# Altium schematic sheet 2016_BeaconEye.SchDoc
size A2
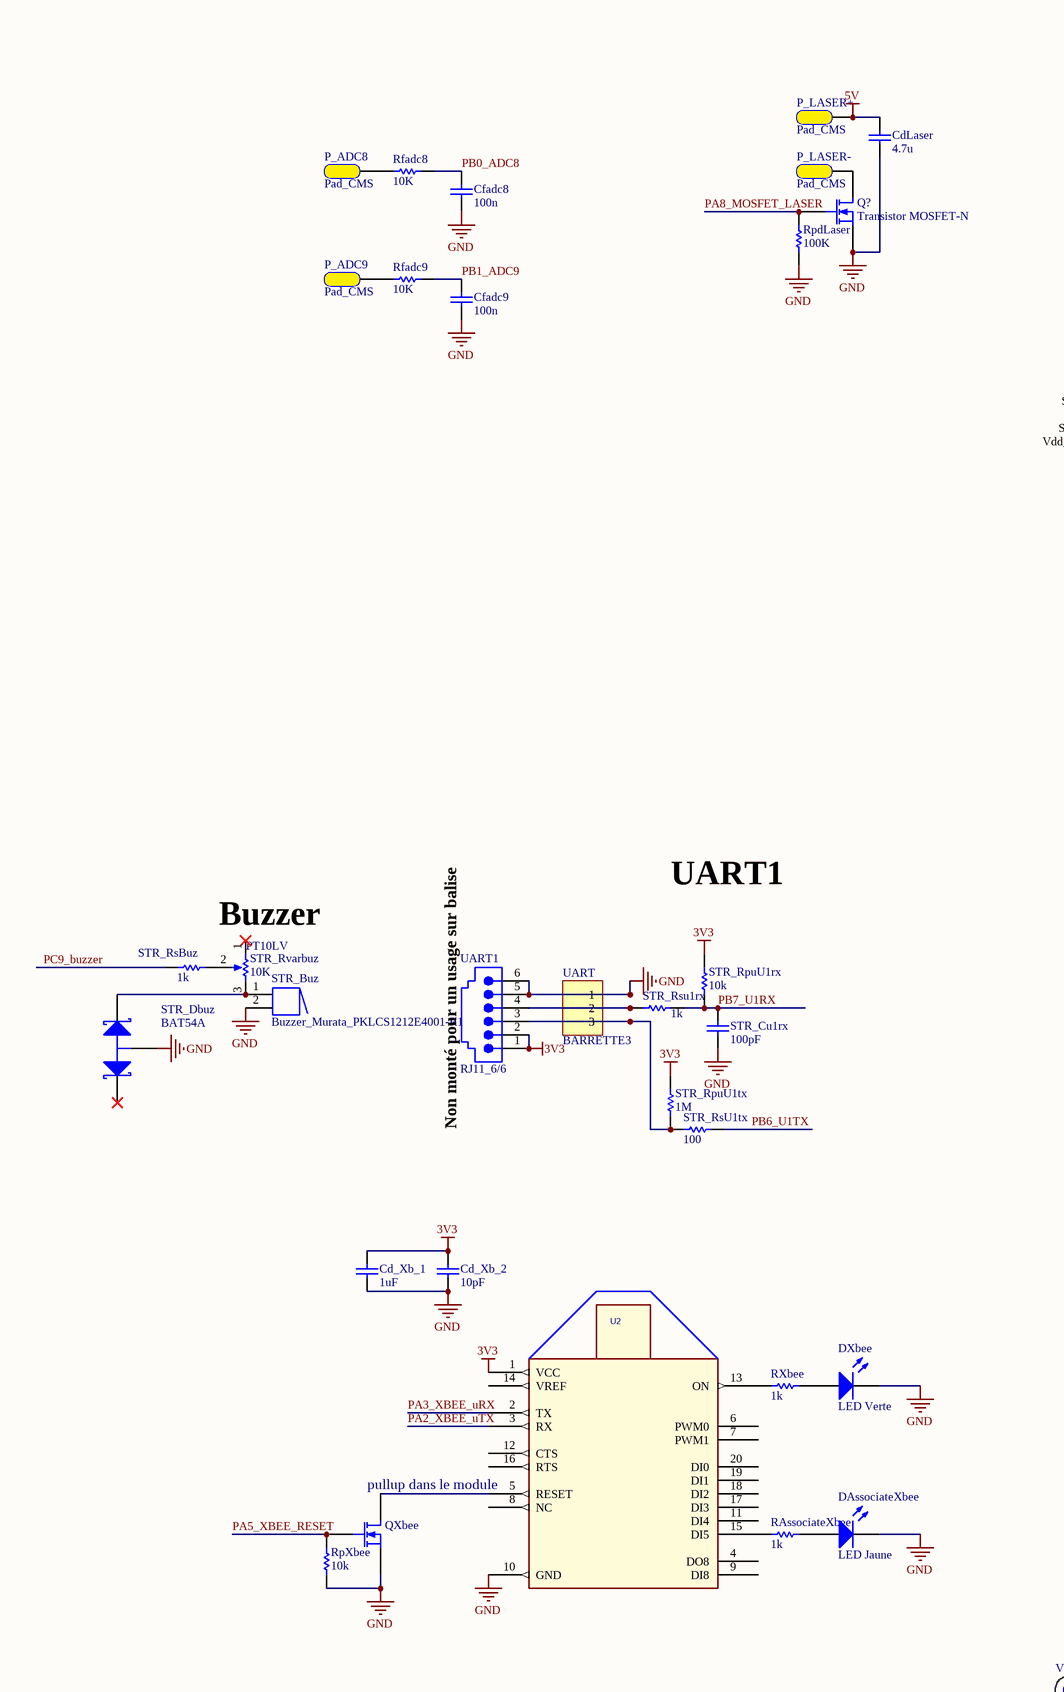
[diagram p0: 2016_BeaconEye.SchDoc, left]
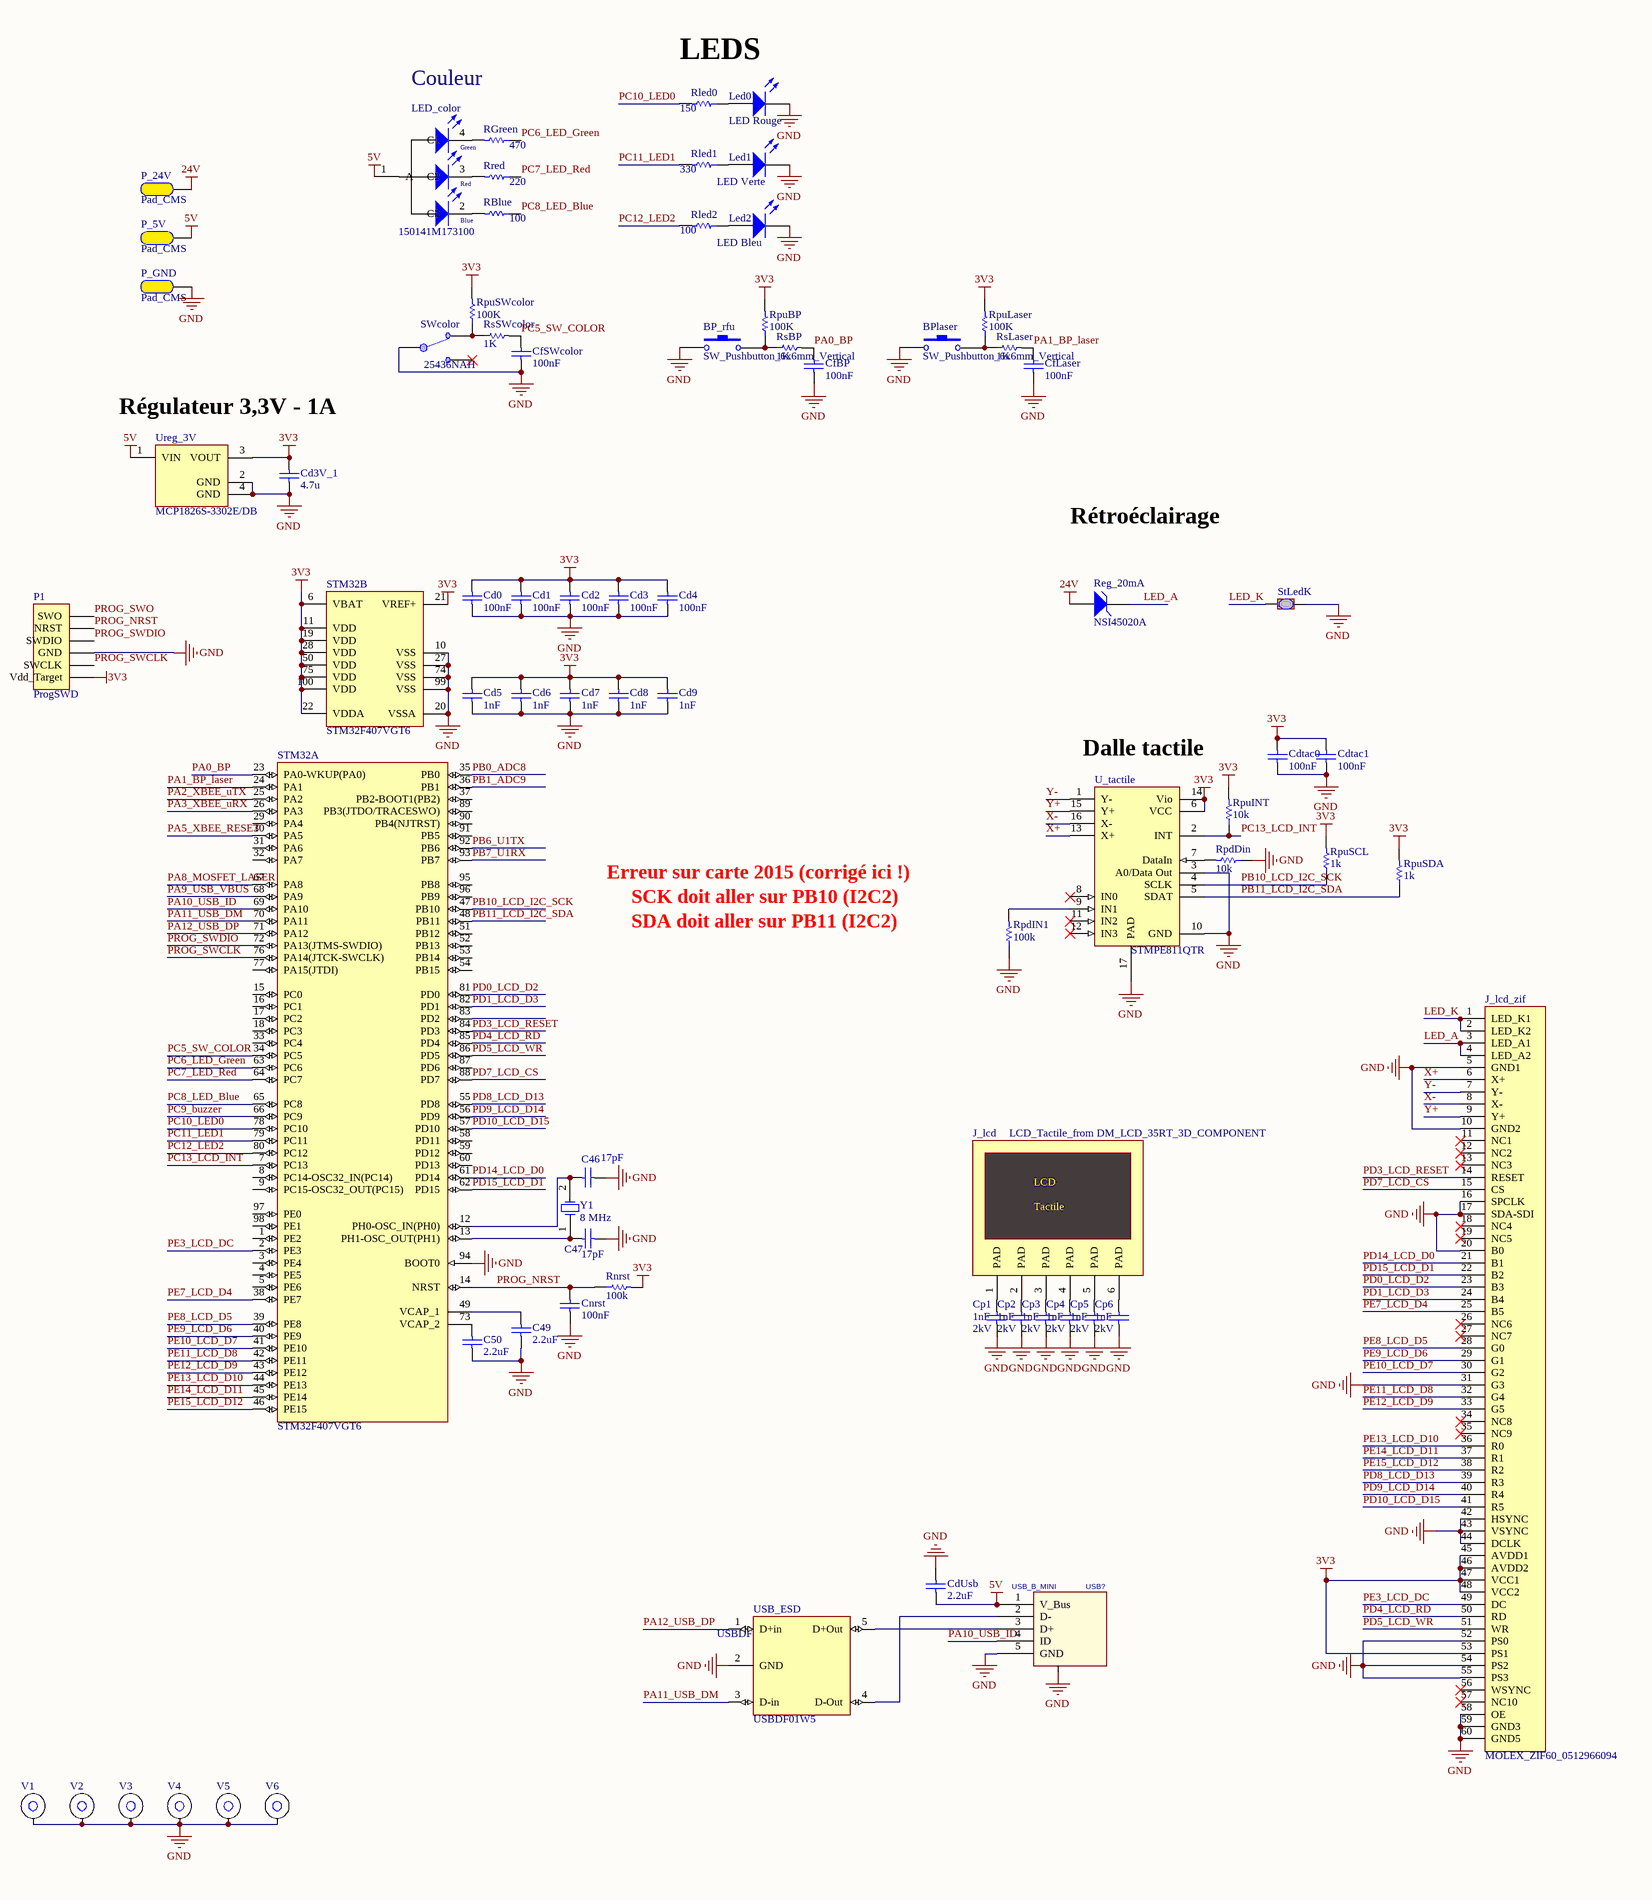
[diagram p1: 2016_BeaconEye.SchDoc, right]

## Parts
BP_rfu  SW_Pushbutton_6x6mm_Vertical  [Switch 6x6 Vertical]
BPlaser  SW_Pushbutton_6x6mm_Vertical  [Switch 6x6 Vertical]
C46  17pF  [C0805_N]
C47  17pF  [C0805_N]
C49  2.2uF  [C0805_N]
C50  2.2uF  [C0805_N]
Cd0  100nF  [C0805_N]
Cd1  100nF  [C0805_N]
Cd2  100nF  [C0805_N]
Cd3  100nF  [C0805_N]
Cd3V_1  4.7u  [C0805_N]
Cd4  100nF  [C0805_N]
Cd5  1nF  [C0805_N]
Cd6  1nF  [C0805_N]
Cd7  1nF  [C0805_N]
Cd8  1nF  [C0805_N]
Cd9  1nF  [C0805_N]
Cd_Xb_1  1uF  [C0805_N]
Cd_Xb_2  10pF  [C0805_N]
CdLaser  4.7u  [C0805_N]
Cdtac0  100nF  [C0805_N]
Cdtac1  100nF  [C0805_N]
CdUsb  2.2uF  [C0805_N]
Cfadc8  100n  [C0805_N]
Cfadc9  100n  [C0805_N]
CfBP  100nF  [C0805_N]
CfLaser  100nF  [C0805_N]
CfSWcolor  100nF  [C0805_N]
Cnrst  100nF  [C0805_N]
Cp1  1nF  Voltage: 2kV  [C1206_N]
Cp2  1nF  Voltage: 2kV  [C1206_N]
Cp3  1nF  Voltage: 2kV  [C1206_N]
Cp4  1nF  Voltage: 2kV  [C1206_N]
Cp5  1nF  Voltage: 2kV  [C1206_N]
Cp6  1nF  Voltage: 2kV  [C1206_N]
DAssociateXbee  LED Jaune  [LED_0805]
DXbee  LED Verte  [LED_0805]
J_lcd  LCD_Tactile_from DM_LCD_35RT_3D_COMPONENT  [LCD_FS-K350QVG-V2-F-01]
J_lcd_zif  MOLEX_ZIF60_0512966094  [ZIF60_0.5MM]
Led0  LED Rouge  [LED_0805]
Led1  LED Verte  [LED_0805]
Led2  LED Bleu  [LED_0805]
LED_color  150141M173100  [3528]
P1  ProgSWD  [HDR1X6]
P_5V  Pad_CMS  [PAD_CMS_5.08x2.54]
P_24V  Pad_CMS  [PAD_CMS_5.08x2.54]
P_ADC8  Pad_CMS  [PAD_CMS_5.08x2.54]
P_ADC9  Pad_CMS  [PAD_CMS_5.08x2.54]
P_GND  Pad_CMS  [PAD_CMS_5.08x2.54]
P_LASER+  Pad_CMS  [PAD_CMS_5.08x2.54]
P_LASER-  Pad_CMS  [PAD_CMS_5.08x2.54]
Q?  Transistor MOSFET-N  [SOT23-3N]
QXbee  Transistor MOSFET-N  [SOT23-3N]  (value not drawn)
RAssociateXbee  1k  [R1206_N]
RBlue  100  [R1206_N]
Reg_20mA  NSI45020A  [SOD123]
Rfadc8  10K  [R1206_N]
Rfadc9  10K  [R1206_N]
RGreen  470  [R1206_N]
Rled0  150  [R1206_N]
Rled1  330  [R1206_N]
Rled2  100  [R1206_N]
Rnrst  100k  [R1206_N]
RpdDin  10k  [R1206_N]
RpdIN1  100k  [R1206_N]
RpdLaser  100K  [R1206_N]
RpuBP  100K  [R1206_N]
RpuINT  10k  [R1206_N]
RpuLaser  100K  [R1206_N]
RpuSCL  1k  [R1206_N]
RpuSDA  1k  [R1206_N]
RpuSWcolor  100K  [R1206_N]
RpXbee  10k  [R1206_N]
Rred  220  [R1206_N]
RsBP  1K  [R1206_N]
RsLaser  1K  [R1206_N]
RsSWcolor  1K  [R1206_N]
RXbee  1k  [R1206_N]
StLedK  Goutte Strap_2  [Goutte Strap_2 Pads_Clearance 0.254mm]  (value not drawn)
STM32  STM32F407VGT6  [STM-LQFP100_N]  (parts A,B of 2)
STR_Buz  Buzzer_Murata_PKLCS1212E4001-R1  [Buzzer_Murata PKLCS1212]
STR_Cu1rx  100pF  [C0805_N]
STR_Dbuz  BAT54A  [SOT23-3N]
STR_RpuU1rx  10k  [R1206_N]
STR_RpuU1tx  1M  [R1206_N]
STR_RsBuz  1k  [R1206_N]
STR_Rsu1rx  1k  [R1206_N]
STR_RsU1tx  100  [R1206_N]
STR_Rvarbuz  value 10K  Type: PT10LV  [Trimmer_Bourns_3314G]  (hidden comment: RESISTANCE_VARIABLE_TRAVERSANTE : PT10LV)
SWcolor  25436NAH  [SW_UNIPOL_DROIT - APEM 18235]
U2  XBee  [MODULE_XBEE]  (value not drawn)
U_tactile  STMPE811QTR  [QFN50P300X300X100_HS-17N]
UART  BARRETTE3  [HDR1X3]
UART1  RJ11_6/6  [RJ11_6/6]
Ureg_3V  MCP1826S-3302E/DB  [SOT223-4N]
USB?  USB_B_MINI  [USB_MICROAB_VERTICAL]
USB_ESD  USBDF01W5  [SOT353_N]
V1  Entretoise WURTH CMS  [ENTRETOISE_CMS]  (value not drawn)
V2  Entretoise WURTH CMS  [ENTRETOISE_CMS]  (value not drawn)
V3  Entretoise WURTH CMS  [ENTRETOISE_CMS]  (value not drawn)
V4  Entretoise WURTH CMS  [ENTRETOISE_CMS]  (value not drawn)
V5  Entretoise WURTH CMS  [ENTRETOISE_CMS]  (value not drawn)
V6  Entretoise WURTH CMS  [ENTRETOISE_CMS]  (value not drawn)
Y1  8 MHz  [HC49/4H_SMX]

## Nets
3V3: Cd0.2 Cd1.2 Cd2.2 Cd3.2 Cd3V_1.2 Cd4.2 Cd5.2 Cd6.2 Cd7.2 Cd8.2 Cd9.2 Cd_Xb_1.2 Cd_Xb_2.2 Cdtac0.2 Cdtac1.2 J_lcd_zif.45(AVDD1) J_lcd_zif.46(AVDD2) J_lcd_zif.47(VCC1) J_lcd_zif.48(VCC2) J_lcd_zif.53(PS1) P1.1(Vdd_Target) Rnrst.2 RpuBP.2 RpuINT.2 RpuLaser.2 RpuSCL.2 RpuSDA.2 RpuSWcolor.2 STM32.6(VBAT) STM32.11(VDD) STM32.19(VDD) STM32.21(VREF+) STM32.22(VDDA) STM32.28(VDD) STM32.50(VDD) STM32.75(VDD) STM32.100(VDD) STR_RpuU1rx.2 STR_RpuU1tx.2 U2.1(VCC) U_tactile.6(VCC) U_tactile.14(Vio) UART1.1 UART1.2 Ureg_3V.3(VOUT)
5V: CdLaser.2 CdUsb.1 LED_color.1(A) P_5V.1 P_LASER+.1 Ureg_3V.1(VIN) USB?.1(V_Bus)
24V: P_24V.1 Reg_20mA.1(A)
GND: BP_rfu.1 BPlaser.1 C46.1 C47.1 C49.1 C50.1 Cd0.1 Cd1.1 Cd2.1 Cd3.1 Cd3V_1.1 Cd4.1 Cd5.1 Cd6.1 Cd7.1 Cd8.1 Cd9.1 Cd_Xb_1.1 Cd_Xb_2.1 CdLaser.1 Cdtac0.1 Cdtac1.1 CdUsb.2 Cfadc8.1 Cfadc9.1 CfBP.1 CfLaser.1 CfSWcolor.1 Cnrst.1 Cp1.1 Cp2.1 Cp3.1 Cp4.1 Cp5.1 Cp6.1 DAssociateXbee.2(K) DXbee.2(K) J_lcd_zif.5(GND1) J_lcd_zif.10(GND2) J_lcd_zif.16(SPCLK) J_lcd_zif.17(SDA-SDI) J_lcd_zif.20(B0) J_lcd_zif.31(G3) J_lcd_zif.42(HSYNC) J_lcd_zif.43(VSYNC) J_lcd_zif.44(DCLK) J_lcd_zif.52(PS0) J_lcd_zif.54(PS2) J_lcd_zif.55(PS3) J_lcd_zif.58(OE) J_lcd_zif.59(GND3) J_lcd_zif.60(GND5) Led0.2(K) Led1.2(K) Led2.2(K) P1.3(GND) P_GND.1 Q?.2(S) QXbee.2(S) RpdDin.1 RpdIN1.1 RpdLaser.1 RpXbee.2 StLedK.2 STM32.10(VSS) STM32.20(VSSA) STM32.27(VSS) STM32.74(VSS) STM32.94(BOOT0) STM32.99(VSS) STR_Buz.2 STR_Cu1rx.1 STR_Dbuz.3(A) SWcolor.COMMON1 U2.10(GND) U_tactile.3(A0/Data_Out) U_tactile.10(GND) U_tactile.17(PAD) UART.1 UART1.5 UART1.6 Ureg_3V.2(GND) Ureg_3V.4(GND) USB?.5(GND) USB?.6(Blindage) USB_ESD.2(GND) V1.1 V2.1 V3.1 V4.1 V5.1 V6.1
LED_A: J_lcd_zif.3(LED_A1) J_lcd_zif.4(LED_A2) Reg_20mA.2(K)
LED_K: J_lcd_zif.1(LED_K1) J_lcd_zif.2(LED_K2) StLedK.1
PA0_BP: CfBP.2 RsBP.2 STM32.23(PA0-WKUP(PA0))
PA1_BP_laser: CfLaser.2 RsLaser.2 STM32.24(PA1)
PA2_XBEE_uTX: STM32.25(PA2) U2.3(RX)
PA3_XBEE_uRX: STM32.26(PA3) U2.2(TX)
PA5_XBEE_RESET: QXbee.1(G) RpXbee.1 STM32.30(PA5)
PA8_MOSFET_LASER: Q?.1(G) RpdLaser.2 STM32.67(PA8)
PA9_USB_VBUS: STM32.68(PA9)
PA10_USB_ID: STM32.69(PA10) USB?.4(ID)
PA11_USB_DM: STM32.70(PA11) USB_ESD.3(D-in)
PA12_USB_DP: STM32.71(PA12) USB_ESD.1(D+in)
PB0_ADC8: Cfadc8.2 Rfadc8.1 STM32.35(PB0)
PB1_ADC9: Cfadc9.2 Rfadc9.1 STM32.36(PB1)
PB6_U1TX: STM32.92(PB6) STR_RsU1tx.2
PB7_U1RX: STM32.93(PB7) STR_Cu1rx.2 STR_RpuU1rx.1 STR_Rsu1rx.1
PB10_LCD_I2C_SCK: RpuSCL.1 STM32.47(PB10) U_tactile.4(SCLK)
PB11_LCD_I2C_SDA: RpuSDA.1 STM32.48(PB11) U_tactile.5(SDAT)
PC5_SW_COLOR: CfSWcolor.2 RsSWcolor.2 STM32.34(PC5)
PC6_LED_Green: RGreen.1 STM32.63(PC6)
PC7_LED_Red: Rred.1 STM32.64(PC7)
PC8_LED_Blue: RBlue.1 STM32.65(PC8)
PC9_buzzer: STM32.66(PC9) STR_RsBuz.1
PC10_LED0: Rled0.2 STM32.78(PC10)
PC11_LED1: Rled1.2 STM32.79(PC11)
PC12_LED2: Rled2.2 STM32.80(PC12)
PC13_LCD_INT: RpuINT.1 STM32.7(PC13) U_tactile.2(INT)
PD0_LCD_D2: J_lcd_zif.23(B3) STM32.81(PD0)
PD1_LCD_D3: J_lcd_zif.24(B4) STM32.82(PD1)
PD3_LCD_RESET: J_lcd_zif.14(RESET) STM32.84(PD3)
PD4_LCD_RD: J_lcd_zif.50(RD) STM32.85(PD4)
PD5_LCD_WR: J_lcd_zif.51(WR) STM32.86(PD5)
PD7_LCD_CS: J_lcd_zif.15(CS) STM32.88(PD7)
PD8_LCD_D13: J_lcd_zif.39(R3) STM32.55(PD8)
PD9_LCD_D14: J_lcd_zif.40(R4) STM32.56(PD9)
PD10_LCD_D15: J_lcd_zif.41(R5) STM32.57(PD10)
PD14_LCD_D0: J_lcd_zif.21(B1) STM32.61(PD14)
PD15_LCD_D1: J_lcd_zif.22(B2) STM32.62(PD15)
PE3_LCD_DC: J_lcd_zif.49(DC) STM32.2(PE3)
PE7_LCD_D4: J_lcd_zif.25(B5) STM32.38(PE7)
PE8_LCD_D5: J_lcd_zif.28(G0) STM32.39(PE8)
PE9_LCD_D6: J_lcd_zif.29(G1) STM32.40(PE9)
PE10_LCD_D7: J_lcd_zif.30(G2) STM32.41(PE10)
PE11_LCD_D8: J_lcd_zif.32(G4) STM32.42(PE11)
PE12_LCD_D9: J_lcd_zif.33(G5) STM32.43(PE12)
PE13_LCD_D10: J_lcd_zif.36(R0) STM32.44(PE13)
PE14_LCD_D11: J_lcd_zif.37(R1) STM32.45(PE14)
PE15_LCD_D12: J_lcd_zif.38(R2) STM32.46(PE15)
PROG_NRST: Cnrst.2 P1.5(NRST) Rnrst.1 STM32.14(NRST)
PROG_SWCLK: P1.2(SWCLK) STM32.76(PA14(JTCK-SWCLK))
PROG_SWDIO: P1.4(SWDIO) STM32.72(PA13(JTMS-SWDIO))
PROG_SWO: P1.6(SWO)
X+: J_lcd_zif.6(X+) U_tactile.13(X+)
X-: J_lcd_zif.8(X-) U_tactile.16(X-)
Y+: J_lcd_zif.9(Y+) U_tactile.15(Y+)
Y-: J_lcd_zif.7(Y-) U_tactile.1(Y-)
NetBP_rfu_3: BP_rfu.3 RpuBP.1 RsBP.1
NetBPlaser_3: BPlaser.3 RpuLaser.1 RsLaser.1
NetC46_2: C46.2 STM32.12(PH0-OSC_IN(PH0)) Y1.2(OSC2)
NetC47_2: C47.2 STM32.13(PH1-OSC_OUT(PH1)) Y1.1(OSC1)
NetC49_2: C49.2 STM32.49(VCAP_1)
NetC50_2: C50.2 STM32.73(VCAP_2)
NetCp1_2: Cp1.2 J_lcd.1(PAD)
NetCp2_2: Cp2.2 J_lcd.2(PAD)
NetCp3_2: Cp3.2 J_lcd.3(PAD)
NetCp4_2: Cp4.2 J_lcd.4(PAD)
NetCp5_2: Cp5.2 J_lcd.5(PAD)
NetCp6_2: Cp6.2 J_lcd.6(PAD)
NetDAssociateXbee_1: DAssociateXbee.1(A) RAssociateXbee.2
NetDXbee_1: DXbee.1(A) RXbee.2
NetLed0_1: Led0.1(A) Rled0.1
NetLed1_1: Led1.1(A) Rled1.1
NetLed2_1: Led2.1(A) Rled2.1
NetLED_color_2: LED_color.2(C3) RBlue.2
NetLED_color_3: LED_color.3(C2) Rred.2
NetLED_color_4: LED_color.4(C1) RGreen.2
NetP_ADC8_1: P_ADC8.1 Rfadc8.2
NetP_ADC9_1: P_ADC9.1 Rfadc9.2
NetP_LASER-_1: P_LASER-.1 Q?.3(D)
NetQXbee_3: QXbee.3(D) U2.5(RESET)
NetRAssociateXbee_1: RAssociateXbee.1 U2.15(DI5)
NetRpdDin_2: RpdDin.2 U_tactile.7(DataIn)
NetRpdIN1_2: RpdIN1.2 U_tactile.9(IN1)
NetRpuSWcolor_1: RpuSWcolor.1 RsSWcolor.1 SWcolor.NC1
NetRXbee_1: RXbee.1 U2.13(ON)
NetSTR_Buz_1: STR_Buz.1 STR_Dbuz.1(K1) STR_Rvarbuz.3
NetSTR_RpuU1tx_1: STR_RpuU1tx.1 STR_RsU1tx.1 UART.3 UART1.3
NetSTR_RsBuz_2: STR_RsBuz.2 STR_Rvarbuz.2
NetSTR_Rsu1rx_2: STR_Rsu1rx.2 UART.2 UART1.4
NetUSB?_2: USB?.2(D-) USB_ESD.4(D-Out)
NetUSB?_3: USB?.3(D+) USB_ESD.5(D+Out)

Not connected (* = marked no-connect by the designer): J_lcd_zif 11(NC1)* 12(NC2)* 13(NC3)* 18(NC4)* 19(NC5)* 26(NC6)* 27(NC7)* 34(NC8)* 35(NC9)* 56(WSYNC)* 57(NC10)*; STM32 1(PE2) 3(PE4) 4(PE5) 5(PE6) 8(PC14-OSC32_IN(PC14)) 9(PC15-OSC32_OUT(PC15)) 15(PC0) 16(PC1) 17(PC2) 18(PC3) 29(PA4) 31(PA6) 32(PA7) 33(PC4) 37(PB2-BOOT1(PB2)) 51(PB12) 52(PB13) 53(PB14) 54(PB15) 58(PD11) 59(PD12) 60(PD13) 77(PA15(JTDI)) 83(PD2) 87(PD6) 89(PB3(JTDO/TRACESWO)) 90(PB4(NJTRST)) 91(PB5) 95(PB8) 96(PB9) 97(PE0) 98(PE1); STR_Dbuz 2(K2)*; STR_Rvarbuz 1*; SWcolor NO1*; U2 4(DO8) 6(PWM0) 7(PWM1) 8(NC) 9(DI8) 11(DI4) 12(CTS) 14(VREF) 16(RTS) 17(DI3) 18(DI2) 19(DI1) 20(DI0); U_tactile 8(IN0)* 11(IN2)* 12(IN3)*

## Notes on the sheet
- Couleur
- LEDS
- Régulateur 3,3V - 1A
- Rétroéclairage
- Dalle tactile
- Erreur sur carte 2015 (corrigé ici !)
- SCK doit aller sur PB10 (I2C2)
- SDA doit aller sur PB11 (I2C2)
- (near STR_Rvarbuz) Buzzer
- UART1
- (near UART1) Non monté pour un usage sur balise
- (near U2) pullup dans le module
- (near USB_ESD) USBDF01W5
- Title
- Size:
- Date:
- File:
- A2
- Number:
- Time:
- Revision:
- Sheet
- of
- (in symbol LCD_Tactile_from DM_LCD_35RT_3D_COMPONENT) LCD; Tactile
- (in symbol WL-SFTW 3528 150141M173100) Green; Red; Blue

## Library data of the parts
BP_rfu BPlaser = SW_Pushbutton_6x6mm_Vertical: Switch tactil 6mm x 6mm Vertical; Published: 27/11/09; PackageReference: 6mm X 6mm; Publisher: Damien Guitton
C46 C47 C49 C50 Cd0-Cd9 Cd_Xb_1 Cd_Xb_2 Cdtac0 Cdtac1 CdUsb CfBP CfLaser CfSWcolor Cnrst Cp1-Cp6 STR_Cu1rx = Condensateur: Capacitor; Published: 8-Jun-2000; LatestRevisionDate: 17-Jul-2002; LatestRevisionNote: Re-released for DXP Platform.; PackageReference: RAD-0.3; Publisher: Altium Limited
Cd3V_1 CdLaser Cfadc8 Cfadc9 = Capacitor: Published: 8-Jun-2000; LatestRevisionDate: 17-Jul-2002; LatestRevisionNote: Re-released for DXP Platform.; PackageReference: RAD-0.3; Publisher: Altium Limited
DAssociateXbee DXbee Led0-Led2 = LED: Typical LED; Published: 8-Jun-2000; LatestRevisionDate: 08-Jul-2005; LatestRevisionNote: Mech Layer 1 removed.; PackageReference: LED-1; Publisher: Altium Limited
J_lcd = LCD_Tactile_from DM_LCD_35RT_3D_COMPONENT: Header for ZIF cable, 60-Pin, pitch 0.5mm; LatestRevisionDate: 17-Jul-2002; LatestRevisionNote: Re-released for DXP Platform.; Publisher: Altium Limited
J_lcd_zif = LCD_Tactile_from DM_LCD_35RT: Header for ZIF cable, 60-Pin, pitch 0.5mm; LatestRevisionDate: 17-Jul-2002; LatestRevisionNote: Re-released for DXP Platform.; Publisher: Altium Limited
LED_color = WL-SFTW 3528 150141M173100: SMD Full-Color Top LED, WL-SFTW, Red & Green & Blue; Manufacturer: Würth Elektronik eiSos GmbH; PartNo: 150141M173100; ComponentLink1Description: Manufacturer; ComponentLink1URL: http://www.we-online.de; Created by: Christin Otto; Created Date: June 2013; ComponentLink2Description: Datasheet; ComponentLink2URL: http://katalog.we-online.com/led/datasheet/150141M173100.pdf; Color: Red & Green & Blue
P1 = Header 6: Header, 6-Pin; LatestRevisionDate: 17-Jul-2002; LatestRevisionNote: Re-released for DXP Platform.; Publisher: Altium Limited
P_5V P_24V P_ADC8 P_ADC9 P_GND P_LASER+ P_LASER- = Pad_CMS: Pad pour souder un fil; LatestRevisionNote: Mech Layer 1 removed.; PackageReference: PAD_CMS; Publisher: Damien Guitton
Q? QXbee = Transistor MOSFET-N: N-Channel MOSFET; PackageDocument: 1995/1996; Published: 8-Jun-2000; LatestRevisionDate: 17-Jul-2002; LatestRevisionNote: Re-released for DXP Platform.; PackageReference: E3; Publisher: Altium Limited
RAssociateXbee RBlue Rfadc8 Rfadc9 RGreen Rled0-Rled2 Rnrst RpdDin RpdIN1 RpdLaser RpuBP RpuINT RpuLaser RpuSCL RpuSDA RpuSWcolor RpXbee Rred RsBP RsLaser RsSWcolor RXbee STR_RpuU1rx STR_RpuU1tx STR_RsBuz STR_Rsu1rx STR_RsU1tx = Resistor: Published: 8-Jun-2000; LatestRevisionDate: 17-Jul-2002; LatestRevisionNote: Re-released for DXP Platform.; PackageReference: AXIAL-0.5; Publisher: Altium Limited
Reg_20mA = 1N4697: DIODE_Zener; Supplier 1: Mouser; Supplier Part Number 1: 512-1N4697; Supplier 2: Arrow; Supplier Part Number 2: 5269047; Supplier 3: Arrow; Supplier Part Number 3: 47183784; Supplier 4: Arrow; Supplier Part Number 4: 12816477S2968897N5680; Supplier 5: Arrow; Supplier Part Number 5: 49772705; Supplier 6: Arrow; Supplier Part Number 6: 45991834; Supplier 7: Arrow; Supplier Part Number 7: 49772706; Supplier 8: Arrow; Supplier Part Number 8: 49042331; Supplier 9: Arrow; Supplier Part Number 9: 43637625
STM32 = STM32F407VGT6: ARM Cortex-M4 32-bit MCU+FPU, 210 DMIPS, 1024 kB Flash, 192 kB Internal RAM, 82 I/Os, 100-pin LQFP, -40 to 85 degC, Tray; Manufacturer: STMicroelectronics; D/A Converter: 2x12-bit; FLASH Size (Prog) (kB): 1024; I/Os (High Current): 82; Internal RAM Size (kB): 192; Operating Frequency(F) (Processor speed) (MHz): 168; Supply Voltage(Vcc) max (V): 3.6; Supply Voltage(Vcc) min (V): 1.8; DatasheetVersion: Rev. 4; PackageVersion: Rev. 1, 06/2013; PackageReference: LQFP100; PackageDescription: 100-Pin Low Profile Quad Flat Package, 14 x 14 mm Body, 0.5 mm Pitch; Supplier 1: Digi-Key; Supplier Part Number 1: 497-11605-ND; Supplier 2: Farnell; Supplier Part Number 2: 2064368; Supplier 3: Newark; Supplier Part Number 3: 73T2333; Supplier 4: Mouser; Supplier Part Number 4: 511-STM32F407VGT6; Core: ARM Cortex-M4; Packing: Tray; Mounting Technology: Surface Mount; PartNumber: STM32F407VGT6; ComponentLink1Description: Manufacturer URL; ComponentLink1URL: http://www.st.com/web/en/home.html; ComponentLink2Description: Datasheet; ComponentLink2URL: http://www.st.com/st-web-ui/static/active/en/resource/technical/document/datasheet/DM00037051.pdf; ComponentLink3Description: Package Specification; ComponentLink3URL: http://www.st.com/st-web-ui/static/active/en/resource/technical/document/data_brief/DM00071938.pdf
STR_Buz = Buzzer_Murata_PKLCS1212E4001-R1: Manufacturer Description: MURATA - PKLCS1212E4001-R1 - BUZZER CMS 4KHZ; Manufacturer: MURATA; Manufacturer Part Number: PKLCS1212E4001-R1; Supplier 1: Farnell; Supplier Part Number 1: 1192551; Supplier 2: Newark; Supplier Part Number 2: 01M8494; Supplier 3: Mouser; Supplier Part Number 3: 81-PKLCS1212E4001
STR_Dbuz = Diode Shottky double  BAT54A: DIODE SCHOTTKY DOUBLE; Manufacturer: ZETEX; ComponentLink1URL: http://www.farnell.com/datasheets/27632.pdf; ComponentLink1Description: http://www.farnell.com/datasheets/27632.pdf; Supplier Part Number: 9526498; Supplier: Farnell; RoHS: YES; Manufacturer Part Number: BAT54A
STR_Rvarbuz = RESISTANCE_VARIABLE_TRAVERSANTE : PT10LV: RESISTANCE VARIABLE_TRAVERSANTE : PT10LV
SWcolor = SW SPDT- APEM Série 523x: Switch unipolaire a levier
U_tactile = STMPE811QTR: STMPE811QTR S-Touch advanced resistive touchscreen controller
UART = BARRETTE3: Header, 3-Pin; LatestRevisionDate: 17-Jul-2002; LatestRevisionNote: Re-released for DXP Platform.; Publisher: Altium Limited
UART1 = RJ11_6/6: Right Angle, Standard Profile, Offset Latch DECconnect, Flangeless PCB Jack; Ports: 1; Positions/Loaded: Port1 - 6 Offset Latch/6; PerformanceCategory: 3; PCB_Mounting: Thru-Hole; DrillSize: Nominal, Rounded to nearest 0.05mm; PCB_Layout: Complies with Manufacturer's Recommendation.; Published: 25-Jun-2002; DatasheetDocument: 18-Dec-2001; PackageDocument: 18-Dec-2001; PackageReference: 15-43-6110; Publisher: Altium Limited; ComponentLink1Description: Manufacturer Link; ComponentLink1URL: http://www.molex.com/; ComponentLink2Description: Datasheet; ComponentLink2URL: http://www.molex.com/cmc_upload/common_files/1212003_41369catalogpage.pdf; Type: RJ11_6/6
Ureg_3V = MCP1826S-3302E/DB: 1000 mA, Low Voltage, Low Quiescent Current LDO Regulator, 3-Pin SOT-223, Extended Temperature; FirstPublished: 29-Jan-2009; DatasheetVersion: revA, Aug-2007; PackageVersion: revBB, Aug-2009; PackageReference: SOT-223-DB3; Publisher: Altium Limited; PackageDescription: 3-Lead Plastic Small Outline Transistor (DB) [SOT-223]; Supplier 1: Digi-Key; Supplier Part Number 1: MCP1826S-3302E/DB-ND; Supplier 2: Farnell; Supplier Part Number 2: 1578424; Supplier 3: Newark; Supplier Part Number 3: 27M0037; ComponentLink1Description: Datasheet; ComponentLink1URL: http://ww1.microchip.com/downloads/en/DeviceDoc/22057a.pdf; ComponentLink2Description: Packaging Specification; ComponentLink2URL: http://www.microchip.com/stellent/groups/techpub_sg/documents/packagingspec/en012702.pdf; ComponentLink3Description: Microchip.com Home; ComponentLink3URL: http://www.microchip.com/
USB? = USB_B_MINI: Connector; USB; Type B; miniature; Pin Spacing=0.8mm
USB_ESD = USBDF01W5: USB protection ESD
V1-V6 = Entretoise WURTH CMS: Entretoise Wurth; Publisher: Damien Guitton
Y1 = Quartz: Crystal Oscillator; Published: 8-Jun-2000; LatestRevisionDate: 17-Jul-2002; LatestRevisionNote: Re-released for DXP Platform.; PackageReference: R38; Publisher: Altium Limited
StLedK = Goutte Strap_2: LatestRevisionDate: 30/01/11; Publisher: Damien Guitton